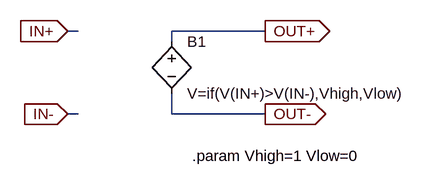
[diagram p0: schematic comparator.asc]
comparator.asc, the LTspice schematic file:
Version 4
SHEET 1 880 680
WIRE 64 64 48 64
WIRE 352 64 208 64
WIRE 208 80 208 64
WIRE 64 192 48 192
WIRE 208 192 208 160
WIRE 352 192 208 192
FLAG 48 64 IN+
IOPIN 48 64 In
FLAG 48 192 IN-
IOPIN 48 192 In
FLAG 352 64 OUT+
IOPIN 352 64 Out
FLAG 352 192 OUT-
IOPIN 352 192 Out
SYMBOL bv 208 64 R0
SYMATTR InstName B1
SYMATTR Value V=if(V(IN+)>V(IN-),Vhigh,Vlow)
TEXT 240 256 Left 2 !.param Vhigh=1 Vlow=0

The netlist it stands for:
* comparator.asc
B1 OUT+ OUT- V=if(V(IN+)>V(IN-),Vhigh,Vlow)
.param Vhigh=1 Vlow=0
.backanno
.end